# Altium project Ras-Pi 3 Board.PrjPcb
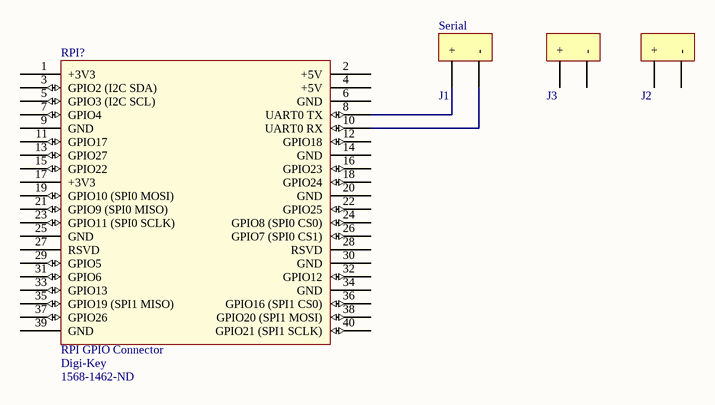
[diagram p0: raspi3_schematic.SchDoc]
1 sheet, 4 parts. Net scope: global (net labels, ports and power ports of the same name join across sheets).
Board file: raspi3_pcb.PcbDoc

## Sheet raspi3_schematic.SchDoc
size A; SheetNumber: 1; SheetTotal: 1

### Parts
J1  Serial
J2  2 Pin Header  (value not drawn)
J3  2 Pin Header  (value not drawn)
RPI?  RPI GPIO Connector  Supplier 1: Digi-Key  Supplier Part Number 1: 1568-1462-ND  [rpi]

### Nets
NetJ1_1: J1.1(+) RPI?.8(UART0_TX)
NetJ1_2: J1.2(-) RPI?.10(UART0_RX)

Not connected (* = marked no-connect by the designer): J2 1(+) 2(-); J3 1(+) 2(-); RPI? 1(+3V3) 2(+5V) 3(GPIO2_(I2C_SDA)) 4(+5V) 5(GPIO3_(I2C_SCL)) 6(GND) 7(GPIO4) 9(GND) 11(GPIO17) 12(GPIO18) 13(GPIO27) 14(GND) 15(GPIO22) 16(GPIO23) 17(+3V3) 18(GPIO24) 19(GPIO10_(SPI0_MOSI)) 20(GND) 21(GPIO9_(SPI0_MISO)) 22(GPIO25) 23(GPIO11_(SPI0_SCLK)) 24(GPIO8_(SPI0_CS0)) 25(GND) 26(GPIO7_(SPI0_CS1)) 27(RSVD) 28(RSVD) 29(GPIO5) 30(GND) 31(GPIO6) 32(GPIO12) 33(GPIO13) 34(GND) 35(GPIO19_(SPI1_MISO)) 36(GPIO16_(SPI1_CS0)) 37(GPIO26) 38(GPIO20_(SPI1_MOSI)) 39(GND) 40(GPIO21_(SPI1_SCLK))

### Library data of the parts
J1 = 2 Pin Header
RPI? = rpi connector: GPIO Header for Raspberry Pi A+/B+/Pi 2/Pi 3 - 2x20; Manufacturer: SparkFun Electronics; Manufacturer Part Number: PRT-14017; Nils Minor: author; nilsminor@web.de: mail; RoHS: RoHS Compliant; Category: Development Boards, Kits, Programmers; Stock 1: 150; Pricing 1: 1=1.84 (EUR); Part Status: Active; Accessory Type: Connector; For Use With/Related Products: Raspberry Pi; ComponentLink1URL: https://cdn.sparkfun.com/datasheets/Dev/RaspberryPi/12313.pdf; ComponentLink1Description: https://cdn.sparkfun.com/datasheets/Dev/RaspberryPi/12313.pdf